# EAGLE design Split-ADA4304-4 (EAGLE 7.2.0)
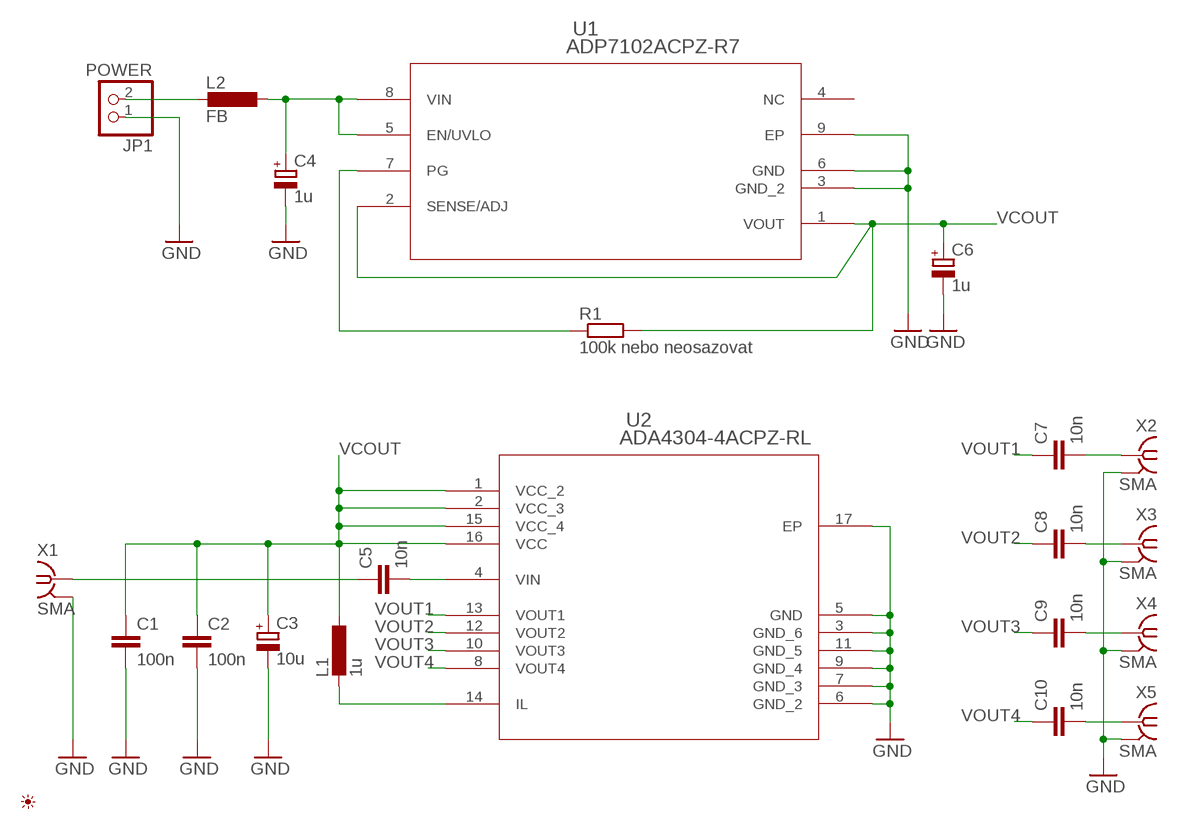
[diagram p0: schematic, sheet 1]

## Parts
C1  100n  C-EUC0603  [C0603]
C2  100n  C-EUC0603  [C0603]
C3  10u  CPOL-EUSMCA  [SMC_A]
C4  1u  CPOL-EUSMCA  [SMC_A]
C5  10n  C-EUC0603  [C0603]
C6  1u  CPOL-EUSMCA  [SMC_A]
C7  10n  C-EUC0603  [C0603]
C8  10n  C-EUC0603  [C0603]
C9  10n  C-EUC0603  [C0603]
C10  10n  C-EUC0603  [C0603]
JP1  POWER  PINHD-1X2  [1X02]
L1  1u  L-EUL2012C  [L2012C]
L2  FB  L-EUL2012C  [L2012C]
PICTO1  PICTO_1  [PICTO_1]
R1  100k nebo neosazovat  R-EU_R0603  [R0603]
U1  ADP7102ACPZ-R7  [CP_8_5]
U2  ADA4304-4ACPZ-RL  [CP_16_2]
X1  SMA  SMA-142-0701-801/806  [J502-ND-142-0701-801/806]
X2  SMA  SMA-142-0701-801/806  [J502-ND-142-0701-801/806]
X3  SMA  SMA-142-0701-801/806  [J502-ND-142-0701-801/806]
X4  SMA  SMA-142-0701-801/806  [J502-ND-142-0701-801/806]
X5  SMA  SMA-142-0701-801/806  [J502-ND-142-0701-801/806]

## Nets
GND: C1.2 C2.2 C3.- C4.- C6.- JP1.1 U1.3(GND_2) U1.6(GND) U1.9(EP) U2.3(GND_6) U2.5(GND) U2.6(GND_2) U2.7(GND_3) U2.9(GND_4) U2.11(GND_5) U2.17(EP) X1.G@1 X1.G@2 X1.G@3 X1.G@4 X2.G@1 X2.G@2 X2.G@3 X2.G@4 X3.G@1 X3.G@2 X3.G@3 X3.G@4 X4.G@1 X4.G@2 X4.G@3 X4.G@4 X5.G@1 X5.G@2 X5.G@3 X5.G@4
N$1: JP1.2 L2.2
N$2: R1.1 U1.7(PG)
N$3 [RF]: C7.2 X2.1
N$4 [RF]: C8.2 X3.1
N$5 [RF]: C9.2 X4.1
N$6 [RF]: C5.1 X1.1
N$7 [RF]: C5.2 U2.4(VIN)
N$8: L1.2 U2.14(IL)
N$9 [RF]: C10.2 X5.1
VCIN: C4.+ L2.1 U1.5(EN/UVLO) U1.8(VIN)
VCOUT: C1.1 C2.1 C3.+ C6.+ L1.1 R1.2 U1.1(VOUT) U1.2(SENSE/ADJ) U2.1(VCC_2) U2.2(VCC_3) U2.15(VCC_4) U2.16(VCC)
VOUT1: C7.1 U2.13(VOUT1)
VOUT2: C8.1 U2.12(VOUT2)
VOUT3: C9.1 U2.10(VOUT3)
VOUT4: C10.1 U2.8(VOUT4)
Unconnected: U1.4(NC)

## Library data of the parts
C1 C2 C5 C7-C10 = rcl:C-EU: CAPACITOR, European symbol
C3 C4 C6 = rcl:CPOL-EU: POLARIZED CAPACITOR, European symbol
JP1 = pinhead:PINHD-1X2: PIN HEADER
L1 L2 = rcl:L-EU: INDUCTOR, European symbol
PICTO1 = My_Picto:PICTO_1: Zdenek Brichacek; OK3ZB; http://blog.brichacek.net
R1 = rcl:R-EU_: RESISTOR, European symbol
U1 = Analog Devices:ADP7102ACPZ-R7
U2 = Analog Devices:ADA4304-4ACPZ-RL
X1-X5 = con-coax:SMA-: SMA 50 Ohm End Launch Jack Receptacle - Round Contact Johnson Components Source: www.johnsoncomponents.com .. J502-ND.pdf; MF: JOHNSON COMPONENTS; MPN: 142-0701-801; OC_FARNELL: 1608592; OC_NEWARK: 90F2624

## Net classes
1 RF: width 2.5 mm, clearance 0.508 mm
2 net: width 0.6 mm, clearance 0.254 mm

## Board
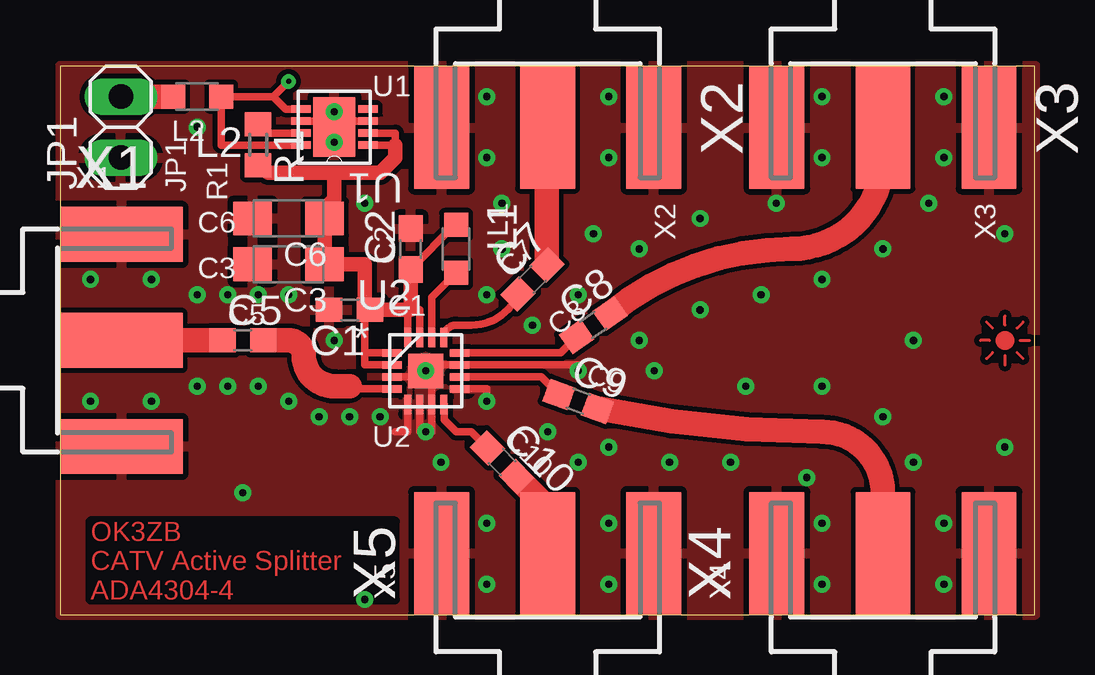
[diagram p1: board, top side]
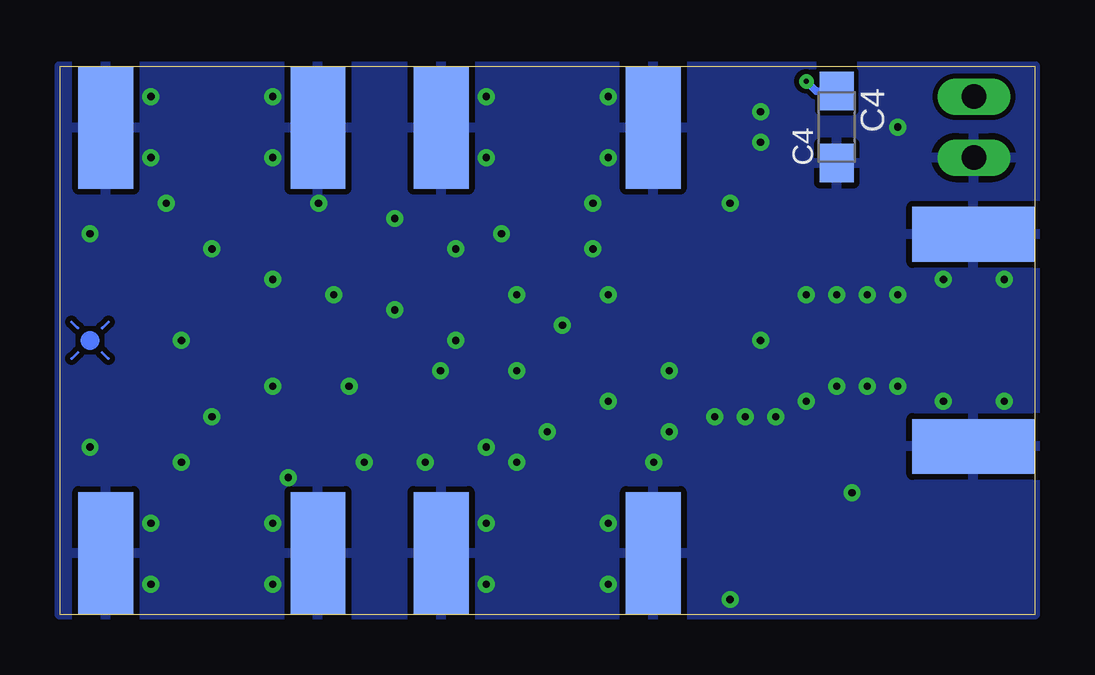
[diagram p2: board, bottom side, seen from below]

Size 40.62 x 22.86 mm. Coordinates in mm from the lower left corner, seen from the top.
Outline: 0,0 40.62,0 40.62,22.86 0,22.86 0,0
Copper layers (1*16): Top 0.035mm / dielectric 1.5mm / Bottom 0.035mm
Design rules "default *": minimum track width 10mil, minimum drill 24mil, track to track 8mil, track to pad 8mil, pad to pad 8mil, via to via 8mil, smd to smd 8mil, copper to edge 0mil, drill to drill 8mil, minimum pad ring 10mil, minimum via ring 8mil, stop-mask expansion 4mil, vias tented up to drill 0mil, thermal gap 10mil

### Footprints (pad centres in the part's own frame; a part is rotated, then mirrored left to right if it is on the bottom)
C0603 = smd 1.1 x 1: 1 -0.85,0; 2 0.85,0
SMC_A = smd 1.6 x 1.4: + -1.5,0; - 1.5,0
1X02 = drill 1.016 long: 1 -1.27,0; 2 1.27,0
L2012C = smd 1 x 1: 1 -1,0; 2 1,0
R0603 = smd 1 x 1.1: 1 -0.85,0; 2 0.85,0
CP_8_5 = smd 0.813 x 0.305: 1 -1.397,0.75; 2 -1.397,0.25; 3 -1.397,-0.25; 4 -1.397,-0.75; 5 1.397,-0.75; 6 1.397,-0.25; 7 1.397,0.25; 8 1.397,0.75 | smd 1.753 x 2.489: 9 0,0
CP_16_2 = smd 0.813 x 0.305: 1 -1.397,0.75; 2 -1.397,0.25; 3 -1.397,-0.25; 4 -1.397,-0.75; 9 1.397,-0.75; 10 1.397,-0.25; 11 1.397,0.25; 12 1.397,0.75 | smd 0.305 x 0.813: 5 -0.75,-1.397; 6 -0.25,-1.397; 7 0.25,-1.397; 8 0.75,-1.397; 13 0.75,1.397; 14 0.25,1.397; 15 -0.25,1.397; 16 -0.75,1.397 | smd 1.448 x 1.448: 17 0,0
J502-ND-142-0701-801/806 = smd 5.08 x 2.286: 1 2.565,0; G@1 2.565,4.42; G@2 2.565,-4.42 | smd 5.08 x 2.286 bottom: G@3 2.565,4.42; G@4 2.565,-4.42

### Placement (x,y rotation side)
C1  12.06,12.7 180 top
C2  14.61,15.24 90 top
C3  9.53,14.61 180 top
C4  8.26,20.32 270 bottom
C5  7.62,11.43 0 top
C6  9.53,16.51 180 top
C7  19.68,13.97 45 top
C8  22.23,12.06 35 top
C9  21.59,8.89 340 top
C10  18.41,6.35 315 top
JP1  2.54,20.32 90 top
L1  16.51,15.24 270 top
L2  5.71,21.59 180 top
PICTO1  39.37,11.43 0 top
R1  8.26,19.58 270 top
U1  11.43,20.32 180 top
U2  15.24,10.16 0 top
X1  0,11.43 0 top
X2  20.32,22.86 270 top
X3  34.29,22.86 270 top
X4  34.29,0 90 top
X5  20.32,0 90 top

### Tracks (layer width: path | path; a pad name or v marks a point on that pad's centre or on a via)
GND  (via drill 0.3)
  Top 0.305: U2.3 15.24,9.91 U2.17 | U2.6 14.99,7.62 15.49,7.62 U2.7 15.49,10.16 U2.17 | U2.17 15.49,10.41 U2.11 21.59,10.41 v21.59,10.16 | U2.9 17.78,9.41 v17.78,8.89 | U1.3 11.43,20.57 | U1.6 11.43,20.57 | 11.43,20.57 U1.9 | U2.5 14.49,7.62 13.97,7.62
  other vias: 1.27,13.97 3.81,13.97 3.81,8.89 1.27,8.89 17.78,21.59 17.78,19.05 22.86,19.05 22.86,21.59 31.75,21.59 31.75,19.05 36.83,19.05 36.83,21.59 36.83,1.27 36.83,3.81 31.75,3.81 31.75,1.27 22.86,1.27 22.86,3.81 17.78,3.81 17.78,1.27 21.59,6.35 20.32,7.62 15.88,6.35 15.24,7.62 6.99,9.53 9.53,8.89 12.06,8.26 9.53,13.34 6.99,13.34 19.68,12.06 21.59,13.34 17.78,13.34 18.41,15.24 18.41,17.14 22.23,15.88 24.13,15.24 26.67,16.51 29.84,17.14 24.13,11.43 26.67,12.7 29.21,13.34 31.75,13.97 34.29,15.24 36.2,17.14 22.86,6.99 25.4,6.35 27.94,6.35 31.11,5.71 35.56,6.35 34.29,8.26 31.75,9.53 28.57,9.53 24.77,10.16 8.26,9.53 8.26,13.34 10.79,8.26 13.34,8.26 11.43,11.43 5.71,9.53 5.71,13.34 15.24,10.16 11.43,19.68 11.43,20.95 5.71,20.32 12.7,0.64 39.37,6.99 39.37,15.88 35.56,11.43 7.62,5.08 12.7,17.14
  pour Top: 0,22.86 0,0 40.64,0 40.64,22.86
  pour Bottom: 0,22.86 0,0 40.64,0 40.64,22.86
N$1
  Top 1.016: JP1.2 L2.2
N$2
  Top 0.305: U1.7 8.72,20.07 R1.1
N$3
  Top 1.016: C7.2 20.29,20.26 arc-90 X2.1
N$4
  Top 1.016: X3.1 34.29,19.05 arc-90 30.48,15.24 arc39 C8.2
N$5
  Top 1.016: X4.1 34.29,5.08 arc90 31.75,7.62 arc-12 C9.2
N$6
  Top 1.016: X1.1 C5.1
N$7
  Top 0.305: 12.06,9.53 arc90 12.18,9.41 U2.4
  Top 1.016: C5.2 9.53,11.43 arc-90 10.16,10.79 arc90 11.43,9.53 12.06,9.53
N$8
  Top 0.305: U2.14 15.49,13.22 L1.2
N$9
  Top 1.016: C10.2 20.32,4.45 X5.1
VCIN  (via drill 0.2)
  Top 0.305: U1.5 9.41,21.07 8.89,21.59 | 8.89,21.59 L2.1 6.71,19.57 U1.8 | 8.89,21.59 v9.53,22.23
  Bottom 0.305: v9.53,22.23 9.12,21.82 C4.+
  Bottom 0.61: C4.+ 8.03,21.59
VCOUT
  Top 0.305: U2.2 12.7,10.41 12.7,10.91 | U2.1 12.7,10.91 | 12.7,10.91 12.7,12.7 C1.1 | U2.15 14.99,12.7 14.61,12.7 14.49,12.7 U2.16 | C2.1 16.45,16.24 L1.1 | U1.1 13.97,19.57 13.97,20.07 U1.2
  Top 0.61: 14.49,12.7 C1.1 | C2.1 14.61,12.7 | 12.7,12.7 12.7,14.61 C3.+ C6.+ 11.03,16.91 11.43,17.32 11.43,18.41 | R1.2 8.68,18.41 11.43,18.41 | 11.43,18.41 13.34,18.41 13.97,19.05 13.97,19.57
VOUT1
  Top 0.305: U2.13 arc-90 16.5,12.06 17.14,12.06 arc68 C7.1
VOUT2
  Top 0.305: U2.12 20.86,10.91 C8.1
VOUT3
  Top 0.305: U2.10 20.06,9.91 C9.1
VOUT4
  Top 0.305: U2.8 16,8.76 16,8.13 16.51,7.62 17.14,7.62 C10.1

### Text on the board
Top: OK3ZB / CATV Active Splitter / ADA4304-4
_tNames: U1 | L2 | JP1 | X1 | R1 | C6 | L1 | X2 | X3 | C3 | C2 | C7 | C1 | C5 | C8 | C9 | U2 | C10 | X5 | X4
_bNames: C4